# Altium schematic sheet FPGA_Peripherals_Control.SchDoc: FPGA_Peripherals_Control
size A3; Date: 18/06/2014; DrawnBy: J. Gabriel R.E.; Organization: Seven Solutions S.L.; Address1: C/Baza, Parcela 19, Nave 3; Address2: Polнgono Ind. Juncaril; Address3: 18210-Peligros-Granada; Address4: Spain; Revision: 3.4; SheetNumber: 22; SheetTotal: 23; WebAddress: www.sevensols.com; Project: White Rabbit; ProjectName: White Rabbit
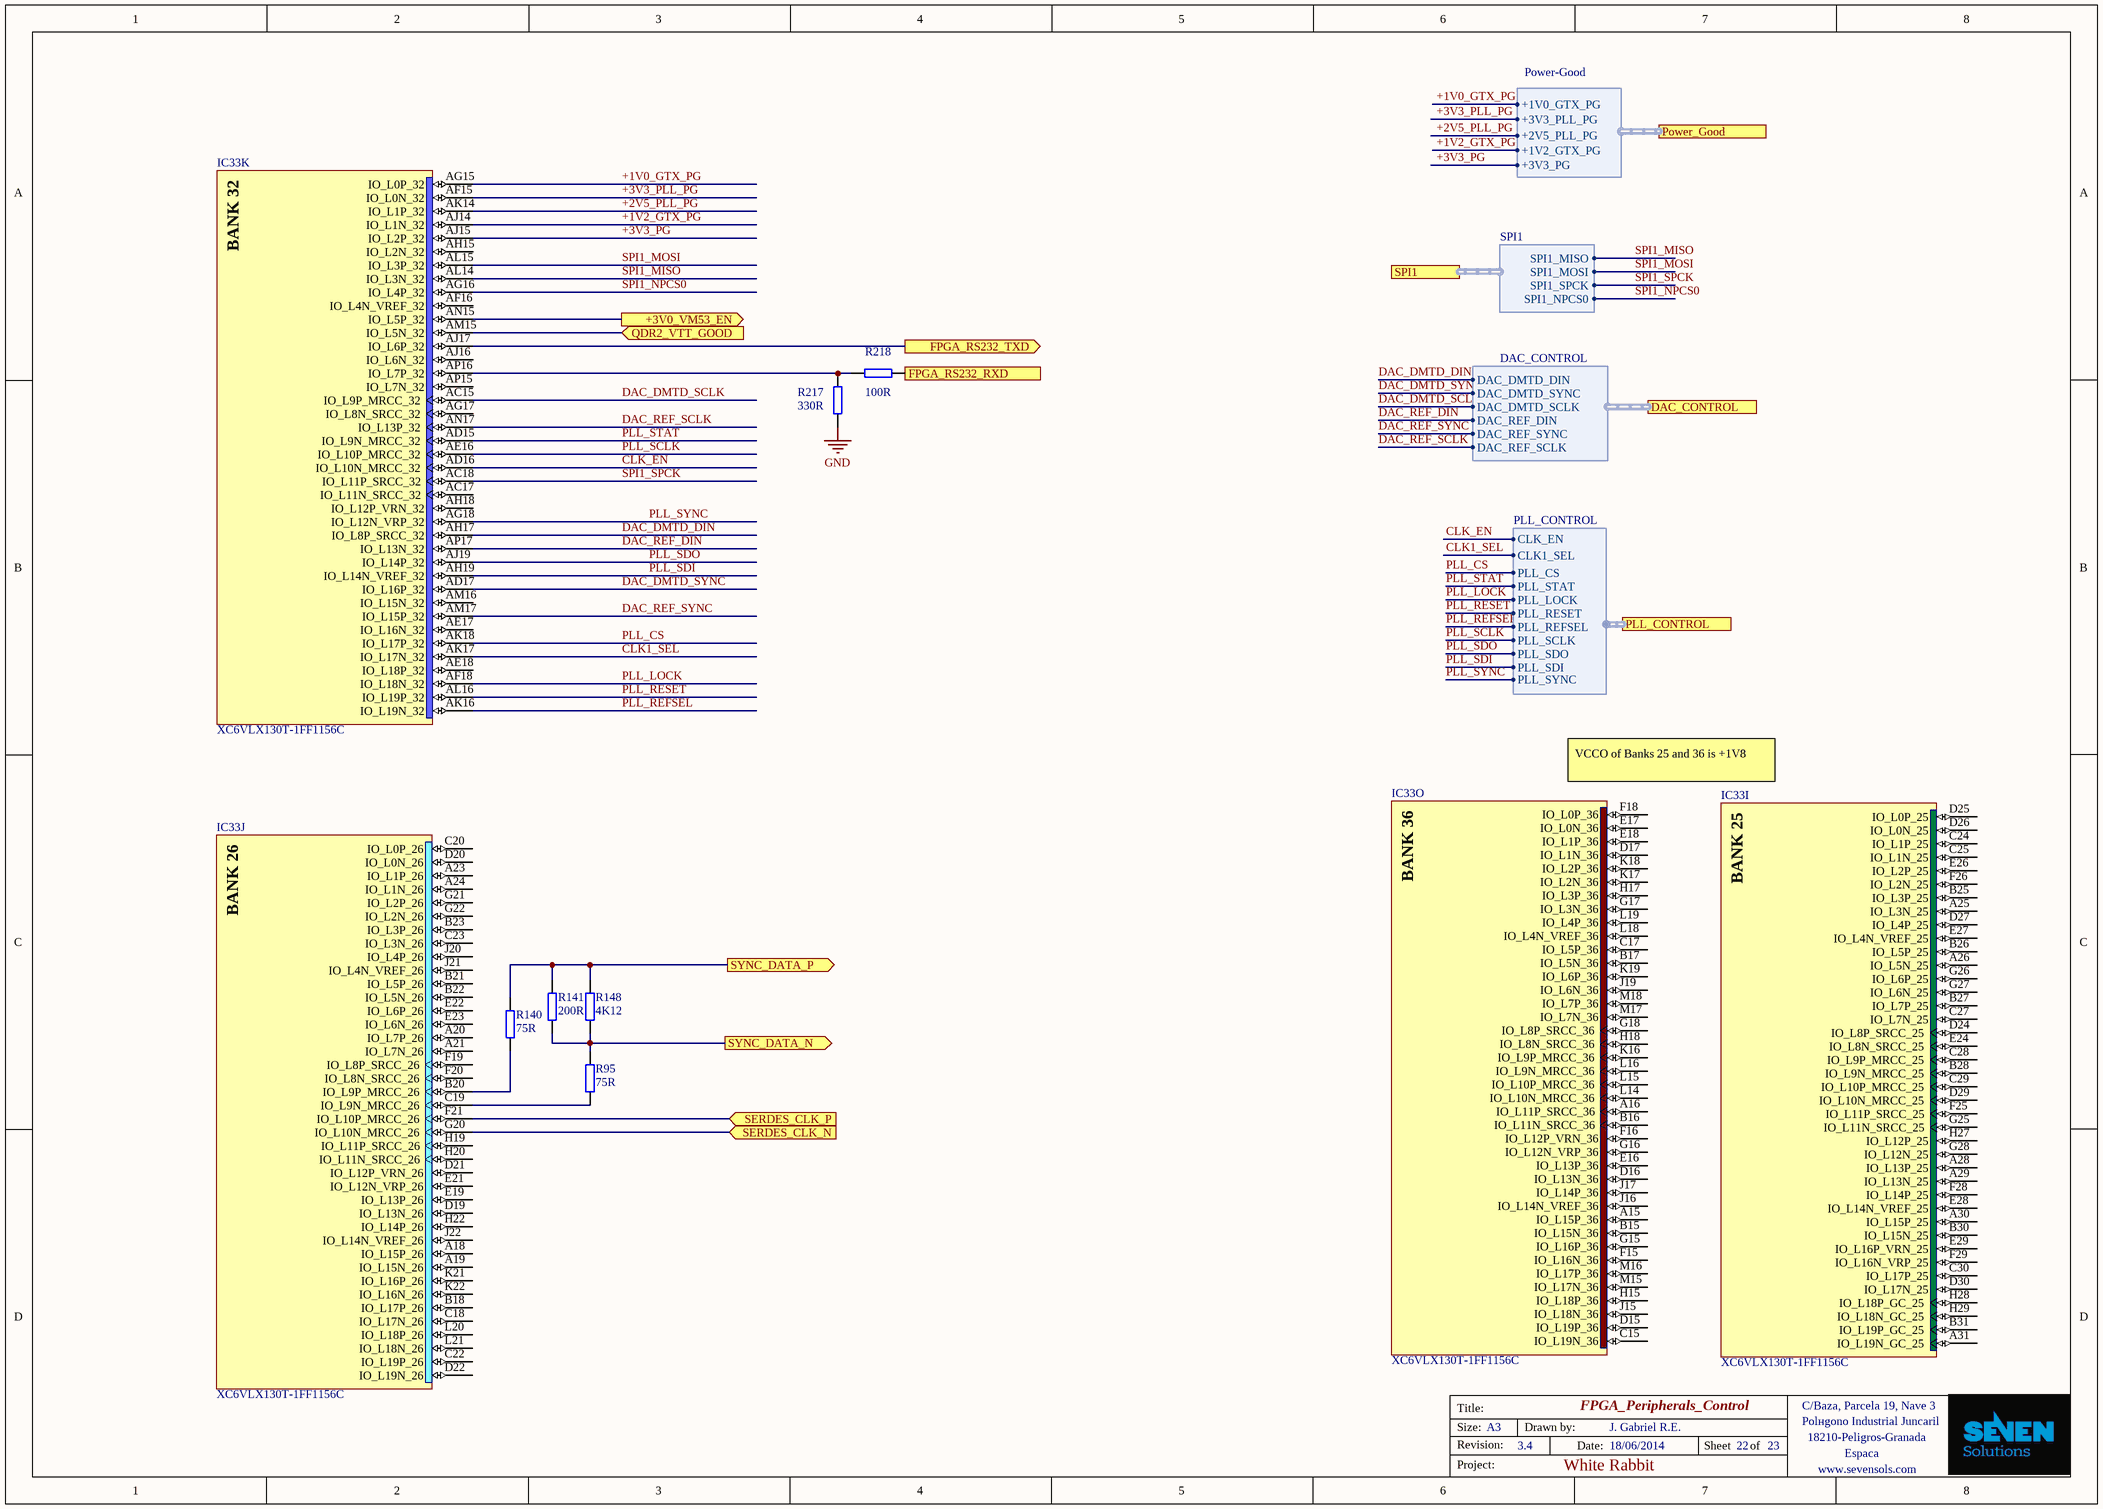
[diagram p0: FPGA_Peripherals_Control.SchDoc]

## Parts
IC33  XC6VLX130T-1FF1156C  [FF1156]  (parts I,J,K,O of 20)
R95  75R  [0402]
R140  75R  [0402]
R141  200R  [0402]
R148  4K12  [0402]
R217  330R  [0402]
R218  100R  [0402]

## Ports
+3V0_VM53_EN (out), DAC_CONTROL (harness DAC_CONTROL), FPGA_RS232_RXD (in), FPGA_RS232_TXD (out), PLL_CONTROL (harness PLL_CONTROL), Power_Good (harness Power-Good), QDR2_VTT_GOOD (in), SERDES_CLK_N (in), SERDES_CLK_P (in), SPI1 (harness SPI1), SYNC_DATA_N (out), SYNC_DATA_P (out)

## Harnesses
SPI1: SPI1_MISO, SPI1_MOSI, SPI1_SPCK, SPI1_NPCS0
Power-Good: +1V2_GTX_PG, +2V5_PLL_PG, +3V3_PLL_PG, +1V0_GTX_PG, +3V3_PG
DAC_CONTROL: DAC_DMTD_DIN, DAC_DMTD_SYNC, DAC_DMTD_SCLK, DAC_REF_DIN, DAC_REF_SYNC, DAC_REF_SCLK
PLL_CONTROL: PLL_CS, PLL_STAT, PLL_LOCK, PLL_RESET, PLL_REFSEL, PLL_SCLK, PLL_SDO, PLL_SDI, PLL_SYNC, CLK1_SEL, CLK_EN

## Nets
GND: R217.1
+1V0_GTX_PG: IC33.AG15(IO_L0P_32) ; port Power_Good.+1V0_GTX_PG
+1V2_GTX_PG: IC33.AJ14(IO_L1N_32) ; port Power_Good.+1V2_GTX_PG
+2V5_PLL_PG: IC33.AK14(IO_L1P_32) ; port Power_Good.+2V5_PLL_PG
+3V0_VM53_EN: IC33.AN15(IO_L5P_32) ; port +3V0_VM53_EN
+3V3_PG: IC33.AJ15(IO_L2P_32) ; port Power_Good.+3V3_PG
+3V3_PLL_PG: IC33.AF15(IO_L0N_32) ; port Power_Good.+3V3_PLL_PG
CLK1_SEL: IC33.AK17(IO_L17N_32) ; port PLL_CONTROL.CLK1_SEL
CLK_EN: IC33.AD16(IO_L10N_MRCC_32) ; port PLL_CONTROL.CLK_EN
DAC_DMTD_DIN: IC33.AH17(IO_L8P_SRCC_32) ; port DAC_CONTROL.DAC_DMTD_DIN
DAC_DMTD_SCLK: IC33.AC15(IO_L9P_MRCC_32) ; port DAC_CONTROL.DAC_DMTD_SCLK
DAC_DMTD_SYNC: IC33.AD17(IO_L16P_32) ; port DAC_CONTROL.DAC_DMTD_SYNC
DAC_REF_DIN: IC33.AP17(IO_L13N_32) ; port DAC_CONTROL.DAC_REF_DIN
DAC_REF_SCLK: IC33.AN17(IO_L13P_32) ; port DAC_CONTROL.DAC_REF_SCLK
DAC_REF_SYNC: IC33.AM17(IO_L15P_32) ; port DAC_CONTROL.DAC_REF_SYNC
FPGA_RS232_RXD: R218.1 ; port FPGA_RS232_RXD
FPGA_RS232_TXD: IC33.AJ17(IO_L6P_32) ; port FPGA_RS232_TXD
PLL_CS: IC33.AK18(IO_L17P_32) ; port PLL_CONTROL.PLL_CS
PLL_LOCK: IC33.AF18(IO_L18N_32) ; port PLL_CONTROL.PLL_LOCK
PLL_REFSEL: IC33.AK16(IO_L19N_32) ; port PLL_CONTROL.PLL_REFSEL
PLL_RESET: IC33.AL16(IO_L19P_32) ; port PLL_CONTROL.PLL_RESET
PLL_SCLK: IC33.AE16(IO_L10P_MRCC_32) ; port PLL_CONTROL.PLL_SCLK
PLL_SDI: IC33.AH19(IO_L14N_VREF_32) ; port PLL_CONTROL.PLL_SDI
PLL_SDO: IC33.AJ19(IO_L14P_32) ; port PLL_CONTROL.PLL_SDO
PLL_STAT: IC33.AD15(IO_L9N_MRCC_32) ; port PLL_CONTROL.PLL_STAT
PLL_SYNC: IC33.AG18(IO_L12N_VRP_32) ; port PLL_CONTROL.PLL_SYNC
QDR2_VTT_GOOD: IC33.AM15(IO_L5N_32) ; port QDR2_VTT_GOOD
SERDES_CLK_N: IC33.G20(IO_L10N_MRCC_26) ; port SERDES_CLK_N
SERDES_CLK_P: IC33.F21(IO_L10P_MRCC_26) ; port SERDES_CLK_P
SPI1_MISO: IC33.AL14(IO_L3N_32) ; port SPI1.SPI1_MISO
SPI1_MOSI: IC33.AL15(IO_L3P_32) ; port SPI1.SPI1_MOSI
SPI1_NPCS0: IC33.AG16(IO_L4P_32) ; port SPI1.SPI1_NPCS0
SPI1_SPCK: IC33.AC18(IO_L11P_SRCC_32) ; port SPI1.SPI1_SPCK
SYNC_DATA_N: R95.2 R141.2 R148.1 ; port SYNC_DATA_N
SYNC_DATA_P: R140.2 R141.1 R148.2 ; port SYNC_DATA_P
NetIC33_AP16: IC33.AP16(IO_L7P_32) R217.2 R218.2
NetIC33_B20: IC33.B20(IO_L9P_MRCC_26) R140.1
NetIC33_C19: IC33.C19(IO_L9N_MRCC_26) R95.1

Not connected (* = marked no-connect by the designer): IC33 A15(IO_L15P_36) A16(IO_L11P_SRCC_36) A18(IO_L15P_26) A19(IO_L15N_26) A20(IO_L7P_26) A21(IO_L7N_26) A23(IO_L1P_26) A24(IO_L1N_26) A25(IO_L3N_25) A26(IO_L5N_25) A28(IO_L13P_25) A29(IO_L13N_25) A30(IO_L15P_25) A31(IO_L19N_GC_25) AC17(IO_L11N_SRCC_32) AE17(IO_L16N_32) AE18(IO_L18P_32) AF16(IO_L4N_VREF_32) AG17(IO_L8N_SRCC_32) AH15(IO_L2N_32) AH18(IO_L12P_VRN_32) AJ16(IO_L6N_32) AM16(IO_L15N_32) AP15(IO_L7N_32) B15(IO_L15N_36) B16(IO_L11N_SRCC_36) B17(IO_L5N_36) B18(IO_L17P_26) B21(IO_L5P_26) B22(IO_L5N_26) B23(IO_L3P_26) B25(IO_L3P_25) B26(IO_L5P_25) B27(IO_L7P_25) B28(IO_L9N_MRCC_25) B30(IO_L15N_25) B31(IO_L19P_GC_25) C15(IO_L19N_36) C17(IO_L5P_36) C18(IO_L17N_26) C20(IO_L0P_26) C22(IO_L19P_26) C23(IO_L3N_26) C24(IO_L1P_25) C25(IO_L1N_25) C27(IO_L7N_25) C28(IO_L9P_MRCC_25) C29(IO_L10P_MRCC_25) C30(IO_L17P_25) D15(IO_L19P_36) D16(IO_L13N_36) D17(IO_L1N_36) D19(IO_L13N_26) D20(IO_L0N_26) D21(IO_L12P_VRN_26) D22(IO_L19N_26) D24(IO_L8P_SRCC_25) D25(IO_L0P_25) D26(IO_L0N_25) D27(IO_L4P_25) D29(IO_L10N_MRCC_25) D30(IO_L17N_25) E16(IO_L13P_36) E17(IO_L0N_36) E18(IO_L1P_36) E19(IO_L13P_26) E21(IO_L12N_VRP_26) E22(IO_L6P_26) E23(IO_L6N_26) E24(IO_L8N_SRCC_25) E26(IO_L2P_25) E27(IO_L4N_VREF_25) E28(IO_L14N_VREF_25) E29(IO_L16P_VRN_25) F15(IO_L16N_36) F16(IO_L12P_VRN_36) F18(IO_L0P_36) F19(IO_L8P_SRCC_26) F20(IO_L8N_SRCC_26) F25(IO_L11P_SRCC_25) F26(IO_L2N_25) F28(IO_L14P_25) F29(IO_L16N_VRP_25) G15(IO_L16P_36) G16(IO_L12N_VRP_36) G17(IO_L3N_36) G18(IO_L8P_SRCC_36) G21(IO_L2P_26) G22(IO_L2N_26) G25(IO_L11N_SRCC_25) G26(IO_L6P_25) G27(IO_L6N_25) G28(IO_L12N_25) H15(IO_L18P_36) H17(IO_L3P_36) H18(IO_L8N_SRCC_36) H19(IO_L11P_SRCC_26) H20(IO_L11N_SRCC_26) H22(IO_L14P_26) H27(IO_L12P_25) H28(IO_L18P_GC_25) H29(IO_L18N_GC_25) J15(IO_L18N_36) J16(IO_L14N_VREF_36) J17(IO_L14P_36) J19(IO_L6N_36) J20(IO_L4P_26) J21(IO_L4N_VREF_26) J22(IO_L14N_VREF_26) K16(IO_L9P_MRCC_36) K17(IO_L2N_36) K18(IO_L2P_36) K19(IO_L6P_36) K21(IO_L16P_26) K22(IO_L16N_26) L14(IO_L10N_MRCC_36) L15(IO_L10P_MRCC_36) L16(IO_L9N_MRCC_36) L18(IO_L4N_VREF_36) L19(IO_L4P_36) L20(IO_L18P_26) L21(IO_L18N_26) M15(IO_L17N_36) M16(IO_L17P_36) M17(IO_L7N_36) M18(IO_L7P_36)

## Notes on the sheet
- (near IC33) VCCO of Banks 25 and 36 is +1V8
- Title:
- Size:
- Revision:
- A3
- Drawn by:
- Date:
- Sheet
- of
- C/Baza, Parcela 19, Nave 3
- Polнgono Industrial Juncaril
- 18210-Peligros-Granada
- Espaсa
- Project:
- www.sevensols.com
- (in symbol XC6VLX130T-1FF1156C, part I) BANK 25
- (in symbol XC6VLX130T-1FF1156C, part J) BANK 26
- (in symbol XC6VLX130T-1FF1156C, part K) BANK 32
- (in symbol XC6VLX130T-1FF1156C, part O) BANK 36

## Library data of the parts
IC33 = XC6VLX130T-1FF1156C: Virtex-6 LXT Platform FPGA, 600 User I/Os, 20 GTXs, 1156-Ball FFBGA, Speed Grade 1, Commercial Grade; FirstPublished: 17-Nov-2009; DatasheetVersion: v2.0, Sep-2009; PackageVersion: ver1.0, Jun-2009; PackageReference: FF1156; Publisher: Altium Limited; PackageDescription: 1156-Ball Flip-Chip Fine Pitch Ball Grid Array (FF1156); Code_JEDEC: MS-034-AAR-1; Code_IPC: BGA100P34X34-1156; ComponentLink1Description: Virtex-6 Datasheet; ComponentLink1URL: http://www.xilinx.com/support/documentation/data_sheets/ds150.pdf; ComponentLink2Description: Pinout Specification; ComponentLink2URL: http://www.xilinx.com/support/packagefiles/virtex-6-pkgs.htm; ComponentLink3Description: FF1156 Package Drawing; ComponentLink3URL: http://www.xilinx.com/support/documentation/package_specs/ff1156.pdf; ComponentLink4Description: Virtex-6 Documents; ComponentLink4URL: http://www.xilinx.com/support/documentation/virtex-6.htm; ComponentLink5Description: Xilinx.com Home; ComponentLink5URL: http://www.xilinx.com
R95 R140 = R0402_75R_±1%_0.1W_100PPM: SMD Resistor; Manufacturer1: Panasonic; Manufacturer1 PN: ERJ-2RKF75R0X; TCR: 100ppm; Power Rating: 0.1W; Tolerance: ±1%; Case: 0402; Distributor1: DigiKey; Distributor1 PN: P75.0LCT-ND; Value: 75R
R141 = R0402_200R_±1%_0.1W_100PPM: SMD Resistor; Manufacturer1: Panasonic; Manufacturer1 PN: ERJ-2RKF2000X; TCR: 100ppm; Power Rating: 0.1W; Tolerance: ±1%; Case: 0402; Distributor1: DigiKey; Distributor1 PN: P200LCT-ND; Value: 200R
R148 = R0402_4K12_±1%_0.1W_100PPM: SMD Resistor; Manufacturer1: Panasonic; Manufacturer1 PN: ERJ-2RKF4121X; TCR: 100ppm; Power Rating: 0.1W; Tolerance: ±1%; Case: 0402; Distributor1: DigiKey; Distributor1 PN: P4.12KLCT-ND; Value: 4K12
R217 = R0402_330R_±1%_0.1W_100PPM: SMD Resistor; Manufacturer1: Panasonic; Manufacturer1 PN: ERJ-2RKF3300X; TCR: 100ppm; Power Rating: 0.1W; Tolerance: ±1%; Case: 0402; Distributor1: DigiKey; Distributor1 PN: P330LCT-ND; Value: 330R
R218 = R0402_100R_±1%_0.1W_100PPM: SMD Resistor; Manufacturer1: Panasonic; Manufacturer1 PN: ERJ-2RKF1000X; TCR: 100ppm; Power Rating: 0.1W; Tolerance: ±1%; Case: 0402; Distributor1: DigiKey; Distributor1 PN: P100LCT-ND; Value: 100R